# EAGLE design AmbaSat-1 version 2.01 (EAGLE 7.7.0)
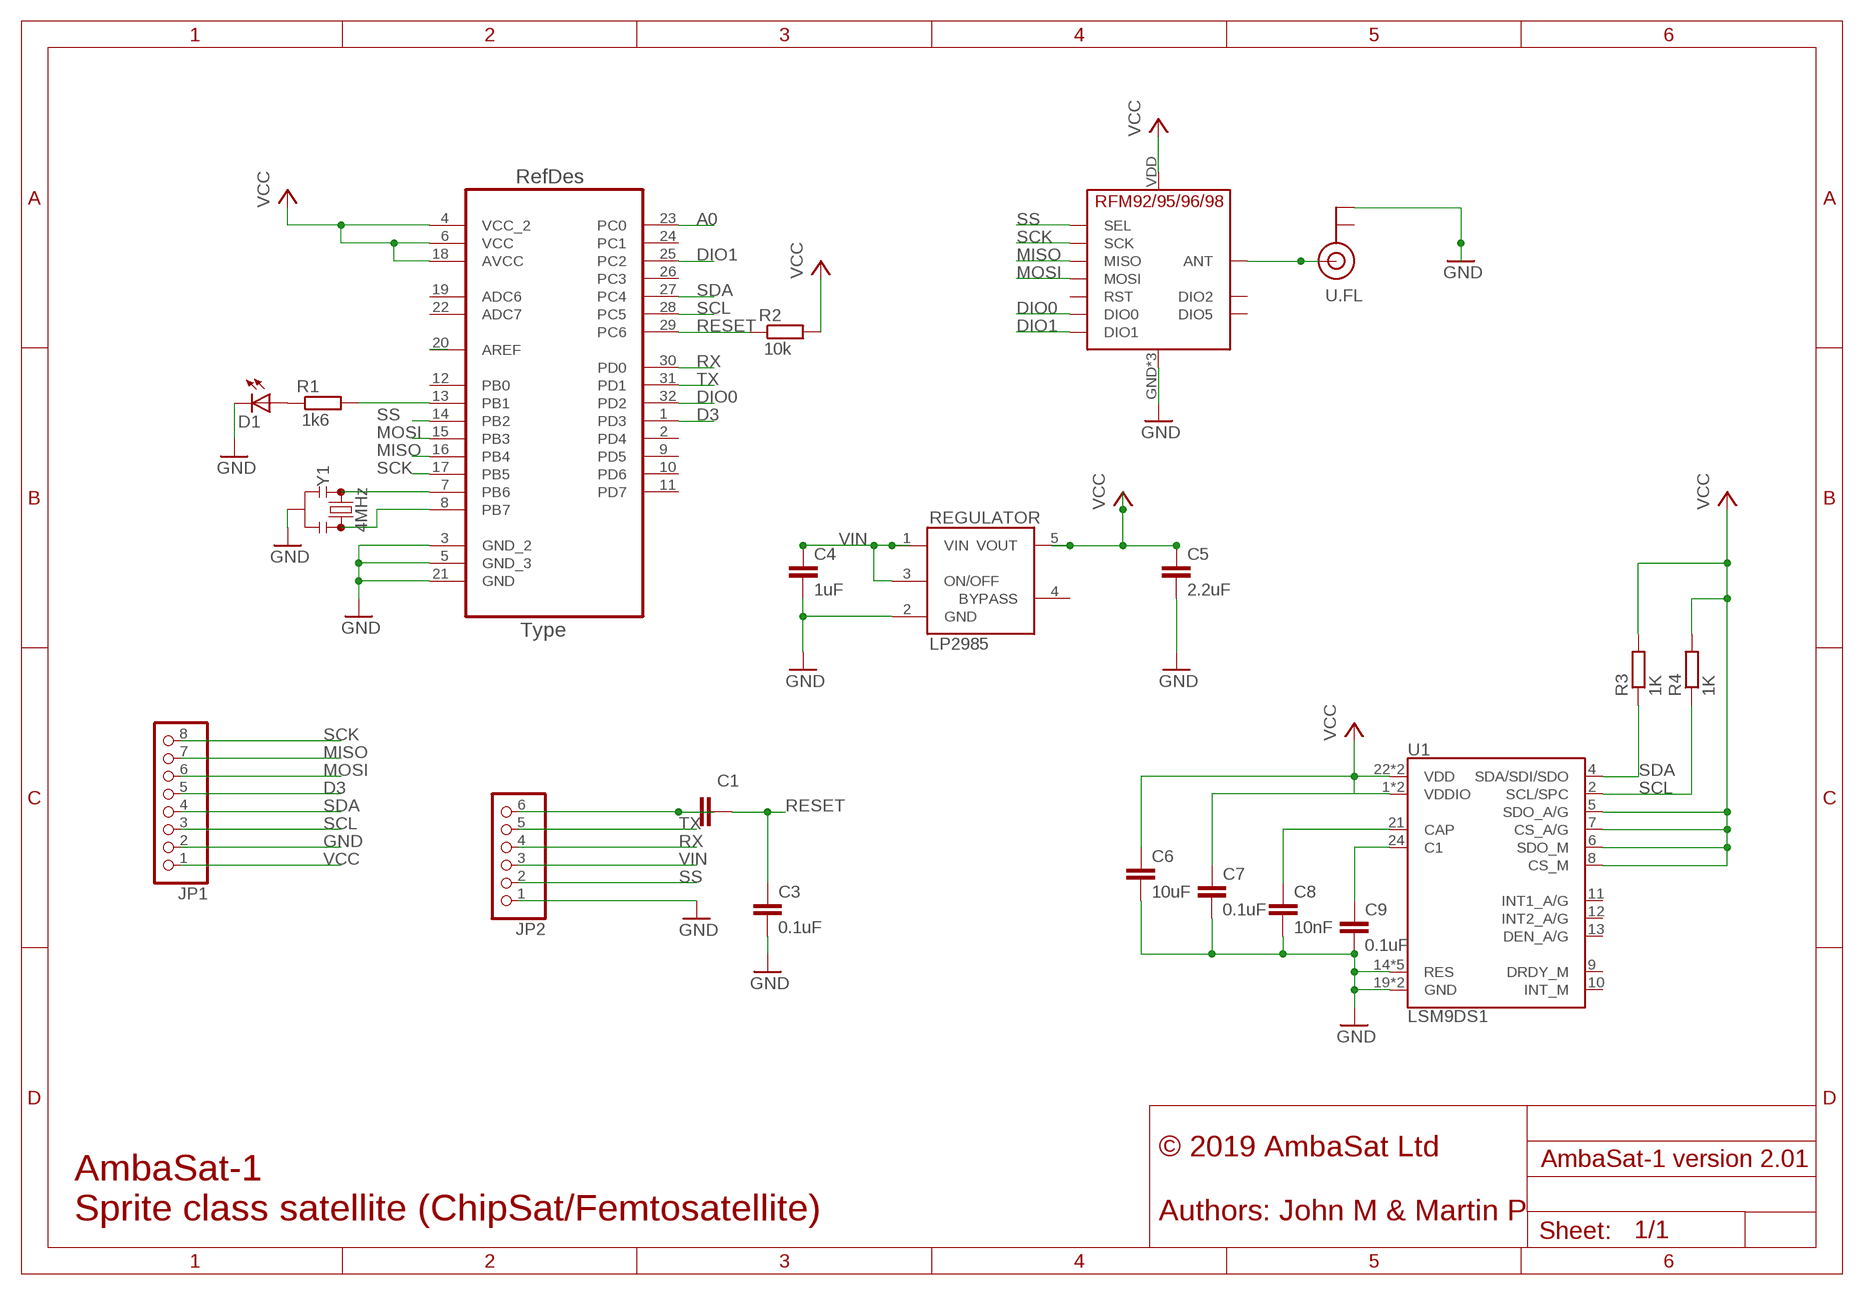
[diagram p0: schematic, sheet 1]

## Parts
ATMEGA328P-AU  ATMEGA328P-AU  [QFP80P900X900X120-32N]
C1  1uF  C-EUC0805K  [C0805K]
C3  0.1uF  C-EUC0805K  [C0805K]
C4  1uF  C-EUC0805K  [C0805K]
C5  2.2uF  C-EUC0805K  [C0805K]
C6  10uF  C-EUC0805K  [C0805K]
C7  0.1uF  C-EUC0805K  [C0805K]
C8  10nF  C-EUC0805K  [C0805K]
C9  0.1uF  C-EUC0805K  [C0805K]
D1  LEDCHIP-LED0805  [CHIP-LED0805]
JP1  PINHD-1X8  [1X08]
JP2  PINHD-1X6  [1X06]
R1  1k6  R-EU_M0805  [M0805]
R2  10k  R-EU_M0805  [M0805]
R3  1K  R-EU_M0805  [M0805]
R4  1K  R-EU_M0805  [M0805]
REGULATOR  LP2985AIM5-3.3  [SOT25]
RFM95  RFM95  [RFM95]
U1  LSM9DS1  [LGA24-8X4]
U.FL  U.FL  [U.FL]
Y1  4MHz  RESONATOR-4MHZSMD-4.5X2  [RESONATOR-SMD-4.5X2.0]

## Nets
A0: ATMEGA328P-AU.23(PC0)
AREF: ATMEGA328P-AU.20(AREF)
D3: ATMEGA328P-AU.1(PD3) JP1.5
DIO0: ATMEGA328P-AU.32(PD2) RFM95.DIO0
DIO1: ATMEGA328P-AU.25(PC2) RFM95.DIO1
GND: ATMEGA328P-AU.3(GND_2) ATMEGA328P-AU.5(GND_3) ATMEGA328P-AU.21(GND) C3.2 C4.2 C5.2 C6.2 C7.2 C8.2 C9.2 D1.C JP1.2 JP2.1 REGULATOR.2(GND) RFM95.GND RFM95.GND1(GND) RFM95.GND2(GND) U1.14(RES) U1.15(RES) U1.16(RES) U1.17(RES) U1.18(RES) U1.19(GND) U1.20(GND) U.FL.2(GND) Y1.2
MISO: ATMEGA328P-AU.16(PB4) JP1.7 RFM95.MISO
MOSI: ATMEGA328P-AU.15(PB3) JP1.6 RFM95.MOSI
N$1: ATMEGA328P-AU.7(PB6) Y1.1
N$2: ATMEGA328P-AU.8(PB7) Y1.3
N$3: ATMEGA328P-AU.13(PB1) R1.2
N$4: D1.A R1.1
N$5: RFM95.ANT U.FL.FEED(SIGNAL)
N$6: C1.2 JP2.6
N$7: C9.1 U1.24(C1)
N$8: C8.1 U1.21(CAP)
RESET: ATMEGA328P-AU.29(PC6) C1.1 C3.1 R2.1
RX: ATMEGA328P-AU.30(PD0) JP2.4
SCK: ATMEGA328P-AU.17(PB5) JP1.8 RFM95.SCK
SCL: ATMEGA328P-AU.28(PC5) JP1.3 R4.1 U1.2(SCL/SPC)
SDA: ATMEGA328P-AU.27(PC4) JP1.4 R3.1 U1.4(SDA/SDI/SDO)
SS: ATMEGA328P-AU.14(PB2) JP2.2 RFM95.NSS(SEL)
TX: ATMEGA328P-AU.31(PD1) JP2.5
VCC: ATMEGA328P-AU.4(VCC_2) ATMEGA328P-AU.6(VCC) ATMEGA328P-AU.18(AVCC) C5.1 C6.1 C7.1 JP1.1 R2.2 R3.2 R4.2 REGULATOR.5(VOUT) RFM95.VDD(VCC) U1.1(VDDIO) U1.3(VDDIO) U1.5(SDO_A/G) U1.6(SDO_M) U1.7(CS_A/G) U1.8(CS_M) U1.22(VDD) U1.23(VDD)
VIN: C4.1 JP2.3 REGULATOR.1(VIN) REGULATOR.3(ON/OFF)
Unconnected: ATMEGA328P-AU.2(PD4) ATMEGA328P-AU.9(PD5) ATMEGA328P-AU.10(PD6) ATMEGA328P-AU.11(PD7) ATMEGA328P-AU.12(PB0) ATMEGA328P-AU.19(ADC6) ATMEGA328P-AU.22(ADC7) ATMEGA328P-AU.24(PC1) ATMEGA328P-AU.26(PC3) REGULATOR.4(BYPASS) RFM95.DIO2 RFM95.DIO5 RFM95.RST U1.9(DRDY_M) U1.10(INT_M) U1.11(INT1_A/G) U1.12(INT2_A/G) U1.13(DEN_A/G) U.FL.1(GND)

## Notes on the sheet
- AmbaSat-1  
  Sprite class satellite (ChipSat/Femtosatellite)
- © 2019 AmbaSat Ltd
  
  Authors: John M & Martin P

## Library data of the parts
ATMEGA328P-AU = Atmel-ATMEGA328P-AU:ATMEGA328P-AU; DESCRIPTION: 8-bit Microcontroller with In-System Programmable Flash; MPN: ATMEGA328P-AU; OC_FARNELL: 1715486; OC_NEWARK: 14R4631; PACKAGE: TQFP-32; SUPPLIER: Atmel
C1 C3-C9 = rcl:C-EU: CAPACITOR, European symbol
D1 = led:LED: LED OSRAM: - CHIPLED LG R971, LG N971, LY N971, LG Q971, LY Q971, LO R971, LY R971 LH N974, LH R974 LS Q976, LO Q976, LY Q976 LO Q996 - Hyper CHIPLED LW Q18S LB Q993, LB Q99A, LB R99A - SideLED LS A670, LO A670, LY A670, LG A670, LP A670 LB A673, LV A673, LT A673, LW A673 LH A674 LY A675 LS A676, LA A676, LO A676, LY A676, LW A676 LS A679, LY A679, LG A679 - Hyper Micro SIDELED® LS Y876, LA Y876, LO Y876, LY Y876 LT Y87S - SmartLED LW L88C, LW L88S LB L89C, LB L89S, LG L890 LS L89K, LO L89K, LY L89K LS L896, LA L896, LO L896, LY L896 - TOPLED LS T670, LO T670, LY T670, LG T670, LP T670 LSG T670, LSP T670, LSY T670, LOP T670, LYG T670 LG T671, LOG T671, LSG T671 LB T673, LV T673, LT T673, LW T673 LH T674 LS T676, LA T676, LO T676, LY T676, LB T676, LH T676, LSB T676, LW T676 LB T67C, LV T67C, LT T67C, LS T67K, LO T67K, LY T67K, LW E67C LS E67B, LA E67B, LO E67B, LY E67B, LB E67C, LV E67C, LT E67C LW T67C LS T679, LY T679, LG T679 LS T770, LO T770, LY T770, LG T770, LP T770 LB T773, LV T773, LT T773, LW T773 LH T774 LS E675, LA E675, LY E675, LS T675 LS T776, LA T776, LO T776, LY T776, LB T776 LHGB T686 LT T68C, LB T68C - Hyper Mini TOPLED® LB M676 - Mini TOPLED Santana® LG M470 LS M47K, LO M47K, LY M47K Source: http://www.osram.convergy.de LUXEON: - LUMILED® LXK2-PW12-R00, LXK2-PW12-S00, LXK2-PW14-U00, LXK2-PW14-V00 LXK2-PM12-R00, LXK2-PM12-S00, LXK2-PM14-U00 LXK2-PE12-Q00, LXK2-PE12-R00, LXK2-PE12-S00, LXK2-PE14-T00, LXK2-PE14-U00 LXK2-PB12-K00, LXK2-PB12-L00, LXK2-PB12-M00, LXK2-PB14-N00, LXK2-PB14-P00, LXK2-PB14-Q00 LXK2-PR12-L00, LXK2-PR12-M00, LXK2-PR14-Q00, LXK2-PR14-R00 LXK2-PD12-Q00, LXK2-PD12-R00, LXK2-PD12-S00 LXK2-PH12-R00, LXK2-PH12-S00 LXK2-PL12-P00, LXK2-PL12-Q00, LXK2-PL12-R00 Source: www.luxeon.com KINGBRIGHT: KA-3528ASYC Source: www.kingbright.com
JP1 = pinhead:PINHD-1X8: PIN HEADER
JP2 = pinhead:PINHD-1X6: PIN HEADER
R1-R4 = rcl:R-EU_: RESISTOR, European symbol
REGULATOR = LP2985:LP2985: LP2985-N Micropower 150 mA Low-Noise Ultra Low-Dropout Regulator
RFM95 = _c2h:RFM95
U1 = LSM9DS1:LSM9DS1: LSM9DS1 3D accelerometer, gyroscope & magnetometer The LSM9DS1 is a system-in-package featuring a 3D digital linear acceleration sensor, a 3D digital angular rate sensor, and a 3D digital magnetic sensor. The LSM9DS1 has a linear acceleration full scale of ±2g/±4g/±8/±16 g, a magnetic field full scale of ±4/±8/±12/±16 gauss and an angular rate of ±245/±500/±2000 dps. The LSM9DS1 includes an I2 C serial bus interface supporting standard and fast mode (100 kHz and 400 kHz) and an SPI serial standard interface. Magnetic, accelerometer and gyroscope sensing can be enabled or set in power-down mode separately for smart power management. The LSM9DS1 is available in a plastic land grid array package (LGA) and it is guaranteed to operate over an extended temperature range from -40 °C to +85 °C.; PROD_ID: IC-12536
U.FL = SparkFun-Connectors:U.FL: SMD Antenna Connector - U.FL 2mm height, 3.0mm x 3.0mm receptacle size. SparkFun Products: SparkFun WiFi Shield - ESP8266 <https://www.sparkfun.com/products/13287> SparkFun ESP8266 Thing <https://www.sparkfun.com/products/13231> SparkFun MiniGen - Pro Mini Signal Generator Shield <https://www.sparkfun.com/products/11420>; PROD_ID: CONN-09193; SF_ID: WRL-09144
Y1 = SparkFun-Clocks:RESONATOR-4MHZ: 4MHz Resonator Digikey Example <http://www.digikey.com/product-search/en?keywords=490-1200-1-ND> Frequency: 4MHz Frequency Stability: ±0.2% Frequency Tolerance: ±0.5% Capacitance: 15pF SparkFun Products SparkFun BadgerHack <https://www.sparkfun.com/products/13333>; PROD_ID: XTAL-12492

## Board
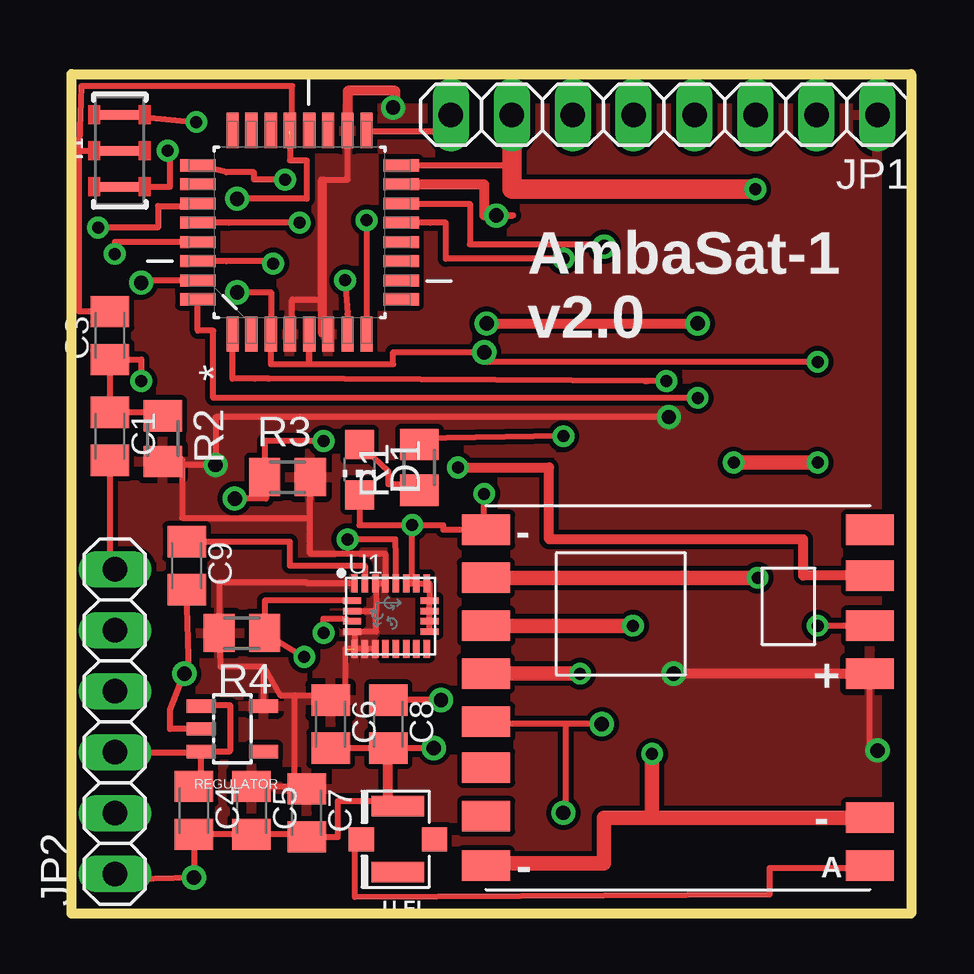
[diagram p1: board, top side]
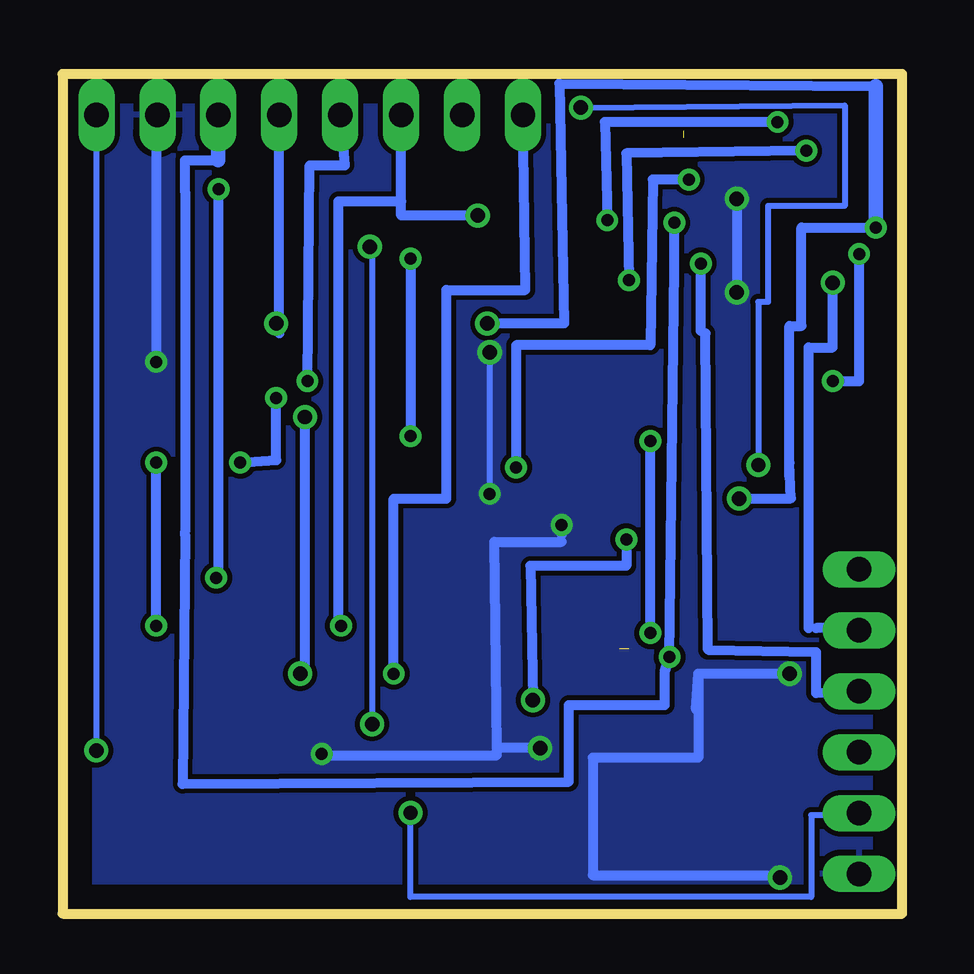
[diagram p2: board, bottom side, seen from below]

Size 35 x 35 mm. Coordinates in mm from the lower left corner, seen from the top.
Outline: 0,0 0,35 35,35 35,0 0,0
Copper layers (1*16): Top 0.035mm / dielectric 1.5mm / Bottom 0.035mm
Design rules "default": minimum track width 10mil, minimum drill 24mil, track to track 8mil, track to pad 8mil, pad to pad 8mil, via to via 8mil, smd to smd 8mil, copper to edge 40mil, drill to drill 8mil, minimum pad ring 10mil, minimum via ring 8mil, stop-mask expansion 4mil, vias tented up to drill 0mil, thermal gap 10mil

### Footprints (pad centres in the part's own frame; a part is rotated, then mirrored left to right if it is on the bottom)
QFP80P900X900X120-32N = smd 1.473 x 0.508: 1 -4.242,2.794; 2 -4.242,2.007; 3 -4.242,1.194; 4 -4.242,0.406; 5 -4.242,-0.406; 6 -4.242,-1.194; 7 -4.242,-2.007; 8 -4.242,-2.794; 17 4.242,-2.794; 18 4.242,-2.007; 19 4.242,-1.194; 20 4.242,-0.406; 21 4.242,0.406; 22 4.242,1.194; 23 4.242,2.007; 24 4.242,2.794 | smd 0.508 x 1.473: 9 -2.794,-4.242; 10 -2.007,-4.242; 11 -1.194,-4.242; 12 -0.406,-4.242; 13 0.406,-4.242; 14 1.194,-4.242; 15 2.007,-4.242; 16 2.794,-4.242; 25 2.794,4.242; 26 2.007,4.242; 27 1.194,4.242; 28 0.406,4.242; 29 -0.406,4.242; 30 -1.194,4.242; 31 -2.007,4.242; 32 -2.794,4.242
C0805K = smd 1.3 x 1.6: 1 -1,0; 2 1,0
CHIP-LED0805 = smd 1.2 x 1.2: A 0,-1.05; C 0,1.05
1X08 = drill 1.016 long: 1 -8.89,0; 2 -6.35,0; 3 -3.81,0; 4 -1.27,0; 5 1.27,0; 6 3.81,0; 7 6.35,0; 8 8.89,0
1X06 = drill 1.016 long: 1 -6.35,0; 2 -3.81,0; 3 -1.27,0; 4 1.27,0; 5 3.81,0; 6 6.35,0
M0805 = smd 1.3 x 1.6: 1 -0.95,0; 2 0.95,0
SOT25 = smd 0.55 x 1.2: 1 -0.95,-1.3; 2 0,-1.3; 3 0.95,-1.3; 4 0.95,1.3; 5 -0.95,1.3
RFM95 = smd 2 x 1.27: ANT 5.777,-7; DIO0 5.777,3; DIO1 5.779,5.095; DIO2 5.779,7; DIO5 -10.225,-4.936; GND 5.777,-5; GND1 -10.223,7; GND2 -10.23,-7; MISO -10.23,5; MOSI -10.225,3; NSS -10.223,-1; RST -10.223,-2.905; SCK -10.23,1.012; VDD 5.777,1
LGA24-8X4 = smd 0.27 x 0.75: 1 -1.505,1.365; 6 -1.505,-1.365; 7 -1.075,-1.365; 8 -0.645,-1.365; 9 -0.215,-1.365; 10 0.215,-1.365; 11 0.645,-1.365; 12 1.075,-1.365; 13 1.505,-1.365; 18 1.505,1.365; 19 1.075,1.365; 20 0.645,1.365; 21 0.215,1.365; 22 -0.215,1.365; 23 -0.645,1.365; 24 -1.075,1.365 | smd 0.75 x 0.27: 2 -1.615,0.645; 3 -1.615,0.215; 4 -1.615,-0.215; 5 -1.615,-0.645; 14 1.615,-0.645; 15 1.615,-0.215; 16 1.615,0.215; 17 1.615,0.645
U.FL = smd 2.2 x 0.85: 1 0,1.375; 2 0,-1.375 | smd 1.05 x 1: FEED 1.525,0; NC -1.525,0
RESONATOR-SMD-4.5X2.0 = smd 0.4 x 1.6: 1 -1.5,0; 2 0,0; 3 1.5,0

### Placement (x,y rotation side)
ATMEGA328P-AU  9.5,28.4 90 top
C1  1.6,19.9 270 top
C3  1.6,24.1 90 top
C4  5.1,4.3 270 top
C5  7.5,4.3 270 top
C6  10.8,7.9 270 top
C7  9.8,4.2 270 top
C8  13.2,7.9 270 top
C9  4.8,14.5 270 top
D1  12,18.5 180 top
JP1  24.7,33.3 180 top
JP2  1.8,8 90 top
R1  14.5,18.6 90 top
R2  3.8,19.8 270 top
R3  9,18.2 0 top
R4  7.1,11.7 180 top
REGULATOR  6.7,7.7 270 top
RFM95  27.5,9 0 top
U1  13.3,12.4 0 top
U.FL  13.6,3.1 180 top
Y1  2,31.8 90 top

### Tracks (layer width: path | path; a pad name or v marks a point on that pad's centre or on a via)
D3  (via drill 0.5)
  Top 0.254: 8.21,22.3 7.64,22.3 | v24.8,22.2 24,22.2 | 23.9,22.2 24,22.2 | 24,22.2 8.24,22.3 7.64,22.3 | 7.64,22.3 6.71,22.3 ATMEGA328P-AU.1
  Bottom 0.254: JP1.5 23.44,33.4
  Bottom 0.406: v24.8,22.2 24.7,31.2 23.24,31.2 23.44,33.4
DIO0  (via drill 0.5)
  Top 0.254: RFM95.DIO0 v31.1,12 | v26.1,21.5 5.9,21.5 5.9,24.3 5.26,24.3 ATMEGA328P-AU.32
  Top 0.61: v31.1,18.8 v27.6,18.8
  Bottom 0.406: v31.1,12 v31.1,18.8 | v27.6,18.8 26.1,18.9 v26.1,21.5
DIO1  (via drill 0.5)
  Top 0.254: v8.9,30.6 7.6,30.6 7.6,30.9 6.46,30.9 ATMEGA328P-AU.25
  Top 0.406: RFM95.DIO1 30.5,14.1 30.5,15.6 19.9,15.6 19.9,18.6 v16.1,18.6
  Bottom 0.406: v8.9,30.6 10.4,30.6 10.5,23.7 16,23.7 16.1,23.7 v16.1,18.6
GND  (via drill 0.5, 0.6)  (1 unrouted)
  Top 0.254: Y1.2 0.3,31.8 0.31,32.1 | 0.31,32.1 0.4,34.5 9.2,34.5 9.2,32.34 9.1,32.34 9.1,31.4 9.8,31.4 9.8,29.8 v6.9,29.8 | 17.27,2.1 RFM95.GND2 | v6.9,25.9 8.31,25.9 ATMEGA328P-AU.3 8.3,22.9 9.9,22.9 | RFM95.GND1 17.3,16 | 9.9,22.9 9.91,22.9 | 9.91,22.9 ATMEGA328P-AU.5 9.9,22.9 | 9.91,22.9 13.4,22.9 13.4,23.4 v17.2,23.4 17.2,23 v31.1,23 | v14.2,16.2 15.5,16.2 15.5,16 RFM95.GND1 | D1.C 12,16.2 v14.2,16.2 | RFM95.GND1 17.2,16 v17.2,17.5 | C3.2 0.31,25.1 0.31,32.1 | U1.14 U1.15 U1.16 U1.17 14.91,13.77 U1.18 U1.19 U1.20 14.2,13.77 v14.2,16.2 | U.FL.2 13.3,4.7 11.1,4.7 11.1,3.2 C7.2 arc90 9.7,3.3 C5.2 C4.2 v5.1,1.5 1.8,1.4 JP2.1 | 10.8,7 C6.2 C8.2 v15.1,6.9 | 2.1,1.6 JP2.1 | 2.1,1.2 JP2.1 | C9.2 4.9,10 v4.7,10 4.1,8.5 4.1,7.7 REGULATOR.2
  Top 0.406: U.FL.2 13.2,4.47 C8.2
  Top 0.61: RFM95.GND 24.2,4 | 24.2,4 22.2,4 22.2,2.1 17.27,2.1 | v24.2,6.66 24.2,4
  Bottom 0.254: v17.2,23.4 v17.2,17.5 | JP1.2 31.1,33.3 | 14.2,15.5 14.2,15.8 | 16.9,6.9 16.9,6.89 | 2.1,1.6 JP2.1
  Bottom 0.406: v6.9,29.8 v6.9,25.9 | 31.1,33.3 v31.1,23 | 14.2,15.8 v14.2,16.2 | v24.2,6.66 24.2,6.6 16.9,6.6 16.9,6.89 17,15.5 14.2,15.5 | v15.1,6.9 16.9,6.9 | v4.7,10 8.5,10 | 8.6,8.5 8.5,10 | 8.5,10 8.5,6.5 12.9,6.5 12.9,1.6 5,1.6 v5.1,1.5
  pour Bottom: 0,35 35.2,35 35.2,0 0,0
MISO  (via drill 0.5)
  Top 0.254: ATMEGA328P-AU.16 18.35,31.19
  Top 0.61: RFM95.MISO v28.6,14
  Top 0.813: v28.5,30.2 18.35,30.2 18.35,31.19 JP1.7
  Bottom 0.254: v28.6,14 28.5,14
  Bottom 0.406: 28.5,14 v28.5,30.2
MOSI  (via drill 0.5, 0.6)
  Top 0.254: 15.1,30.41 15.1,30.4 | 17.2,29.1 18.4,29.11 v17.7,29.1
  Top 0.406: ATMEGA328P-AU.15 15.1,30.41 | 15.1,30.4 17.2,30.4 17.2,29.1
  Top 0.61: RFM95.MOSI v23.4,12
  Bottom 0.254: v23.4,12 23.5,12
  Bottom 0.406: 23.5,12 23.5,29.7 20.89,29.7 | 20.89,29.7 JP1.6 | v17.7,29.1 20.89,29.1 20.89,29.7
N$1  (via drill 0.5)
  Top 0.254: Y1.1 4.1,30.3 4.1,31.8 v4,31.8 | v11.4,26.4 11.5,25.01 ATMEGA328P-AU.7
  Bottom 0.406: v4,31.8 11.5,31.7 v11.4,26.4
N$2  (via drill 0.5)
  Top 0.254: Y1.3 v5.2,33 | v12.3,28.9 12.29,28.6 ATMEGA328P-AU.8
  Bottom 0.406: v5.2,33 12.4,33 v12.3,28.9
N$3  (via drill 0.5)
  Top 0.254: v20.5,27.3 15.6,27.3 15.6,28.8 14.94,28.8 ATMEGA328P-AU.13 | v20.5,19.9 14.4,19.8 14.2,19.8 R1.2
  Bottom 0.406: v20.5,27.3 v20.5,19.9
N$4
  Top 0.254: D1.A 13.2,18.45 13.2,17.9 14.5,17.9 R1.1
N$5
  Top 0.254: U.FL.FEED 11.8,3.1 11.8,0.7 29.1,0.8 29.1,1.9 33.28,1.9 RFM95.ANT
N$6
  Top 0.254: JP2.6 1.6,14.35 C1.2
N$7
  Top 0.254: U1.24 12.22,14.5 9.1,14.5 9.1,15.5 C9.1
N$8  (via drill 0.5, 0.6)
  Top 0.254: v15.4,8.9 C8.1 | U1.21 13.52,14.88 13.5,15.6 v11.5,15.6
  Bottom 0.406: v15.4,8.9 15.5,14.5 11.5,14.5 v11.5,15.6
RESET  (via drill 0.5)
  Top 0.254: v1.8,27.5 1.8,27.99 ATMEGA328P-AU.29 | v2.9,22.2 2.9,23.1 C3.1 C1.1 3.8,20.9 R2.1
  Bottom 0.406: v2.9,22.2 1.8,22.2 v1.8,27.5
RX  (via drill 0.5)
  Top 0.254: v8.4,27.1 8.4,27.2 6.46,27.2 ATMEGA328P-AU.30
  Bottom 0.254: 8.2,24.2 8.4,24.3 | 1.8,9.3 JP2.4
  Bottom 0.406: 8.2,24.2 8.1,11 3.6,10.9 3.6,9.2 1.8,9.3 | 8.4,24.3 v8.4,27.1
SCK  (via drill 0.5)
  Top 0.254: 21.2,10.01 v21.2,10 | JP1.8 15.9,32.6 12.29,32.6 ATMEGA328P-AU.17
  Top 0.61: RFM95.SCK 21.2,10.01
  Bottom 0.406: v21.2,10 21.2,17.3 19,17.3 19,26 15.71,26 JP1.8
SCL  (via drill 0.5)
  Top 0.254: v9.5,28.8 6.56,28.8 ATMEGA328P-AU.28 | 9.7,10.64 v9.7,10.7 R4.1 8.05,13.04 U1.2
  Bottom 0.254: 29.9,30.1 29.92,30.12 29.9,30.12 | 29.9,15.9 29.9,15.8
  Bottom 0.406: v9.5,28.8 9.5,26.9 v9.7,10.7 9.9,10.1 9.9,8.7 13.9,8.7 13.9,5.5 30,5.4 29.9,15.8 | 29.9,30.1 29.9,15.9 | 29.9,30.12 29.9,31.4 28.51,31.4
  Bottom 0.61: 28.51,31.4 JP1.3
SDA  (via drill 0.5, 0.6)
  Top 0.254: v1.1,28.6 3.6,28.6 3.6,29.5 5.26,29.5 ATMEGA328P-AU.27 | v6.8,17.3 8.1,17.3 8.1,17.7 R3.1 8.05,19.7 v10.5,19.7 | v10.5,11.7 10.5,12.3 11.38,12.3 U1.4
  Top 0.406: v17.3,24.6 v26.1,24.6
  Bottom 0.254: 17.4,24.6 v17.3,24.6 | 26.08,24.6 v26.1,24.6 25.97,24.2
  Bottom 0.406: 1.1,34.5 14.3,34.6 14.1,24.6 v17.3,24.6 | 4.7,18.8 4.64,17.32 5.25,17.3 v6.8,17.3 | 4.7,18.2 4.7,18.8 | 4.7,18.8 4.7,24.5 4.2,24.5 4.2,28.6 v1.1,28.6 | 25.97,24.2 JP1.4 | v10.5,11.7 v10.5,19.7
  Bottom 0.61: 1.1,34.5 v1.1,28.6
SS  (via drill 0.6)
  Top 0.254: ATMEGA328P-AU.14 16.6,29.59 16.6,27.9 22.2,27.9 v22.2,27.8 | v22.1,7.9 20.6,7.9 | 20.6,7.9 17.28,7.9 RFM95.NSS | v20.5,4.2 20.6,4.2 20.6,7.9
  Bottom 0.254: v22.2,27.8 22.1,27.8 v22.1,7.9 | v20.5,4.19 v20.5,4.2 20.5,0.7 3.8,0.7 3.8,4.1 1.89,4.1 arc-90 JP2.2
TX  (via drill 0.6)
  Top 0.254: v2.9,26.3 2.7,26.39 ATMEGA328P-AU.31
  Bottom 0.254: 3.6,11.9 3.9,11.9
  Bottom 0.406: v2.9,26.3 2.9,23.6 3.9,23.6 3.9,19.8 3.9,11.9 | JP2.5 2.4,11.91 3.6,11.9
VCC  (via drill 0.6)  (1 unrouted)
  Top 0.254: 10.5,30.6 10.5,25.6 | 10.5,25.6 10.5,24.16 | ATMEGA328P-AU.6 10.5,24.16 | ATMEGA328P-AU.4 9.2,24.16 9.2,25.6 10.5,25.6 | 10.5,30.6 11.51,30.6 ATMEGA328P-AU.18 | U1.23 U1.22 | 9.91,16.29 R3.2 9.95,15 13.09,15 U1.22 | 9.91,16.29 9.9,15.5 | U1.8 U1.7 11.4,11.04 11.4,9.1 | U1.1 9.8,13.77 9.8,13.8 6.15,13.8 R4.2 6.2,10.3 8,10.3 | U1.6 11.79,11.76 U1.5 12.7,11.76 12.7,12.6 | 12.7,12.6 11.69,12.6 U1.3 | U1.22 12.7,13.77 12.7,12.6 | 8,10.3 8.7,9.1 9.3,9.1 | 9.3,9.1 11.4,9.1 | 11.4,9.1 10.9,9 C6.1 | REGULATOR.5 8,10.3 | R2.2 4.6,18.95 4.6,16.5 9.91,16.5 9.91,16.29 | v33.6,6.8 33.28,6.8 RFM95.VDD | 10.5,24.16 10.4,24.16 10.4,30.6 10.5,30.6 | 3.8,18.7 v6,18.7 6,20.7 v24.9,20.7 | C7.1 9.8,5.3 C5.1 9.3,5.3 9.3,9.1
  Top 0.406: v13.4,33.6 13.5,33.6 13.5,34.3 11.51,34.3 ATMEGA328P-AU.18 | 3.8,18.7 R2.2 | RFM95.VDD v25.1,10
  Bottom 0.254: JP1.1 v33.6,6.8 | v13.4,33.6 2.4,33.7 2.4,29.5 5.6,29.5 5.6,25.5 6,25.5 6,18.9
  Bottom 0.406: 6,18.9 v6,18.7 | v25.1,10 24.9,10 v24.9,20.7
  pour Top: 0,35 35,35.1 35,0.1 0,0
VIN
  Top 0.254: JP2.3 5.4,6.73 REGULATOR.3 | 5.4,6.8 REGULATOR.3 | C4.1 5.4,5.4 REGULATOR.3 | REGULATOR.1 arc-90 5.45,8.7 6.6,8.7 6.6,6.8 arc-90 6.55,6.75 REGULATOR.3

### Text on the board
tPlace: AmbaSat-1 / v2.0